# Altium project RFSoC-AMC.PrjPCB (part 4 of 22)

## Sheet AMS_CLOCK.SchDoc: RFSoC AMC
size A2; CompanyName: WUT; DrawnBy: T. Przywozki; Organization: WUT ISE; Address1: Warsaw University of Technology; Address2: Nowowiejska 15/19 00-665 Warsaw; Address3: Tomasz.Przywozki@pw.edu.pl; DocumentNumber: 24; Revision: 1; SheetNumber: 24; SheetTotal: 45; Project: RFSoC AMC; ModifiedBy: T. Przywozki; CreateDate: -; CheckedDate: -; DivGrp: ISE; Designer: T. Przywozki; ModifiedDate: -; ProjectName: ADC/DAC MEZZANINE
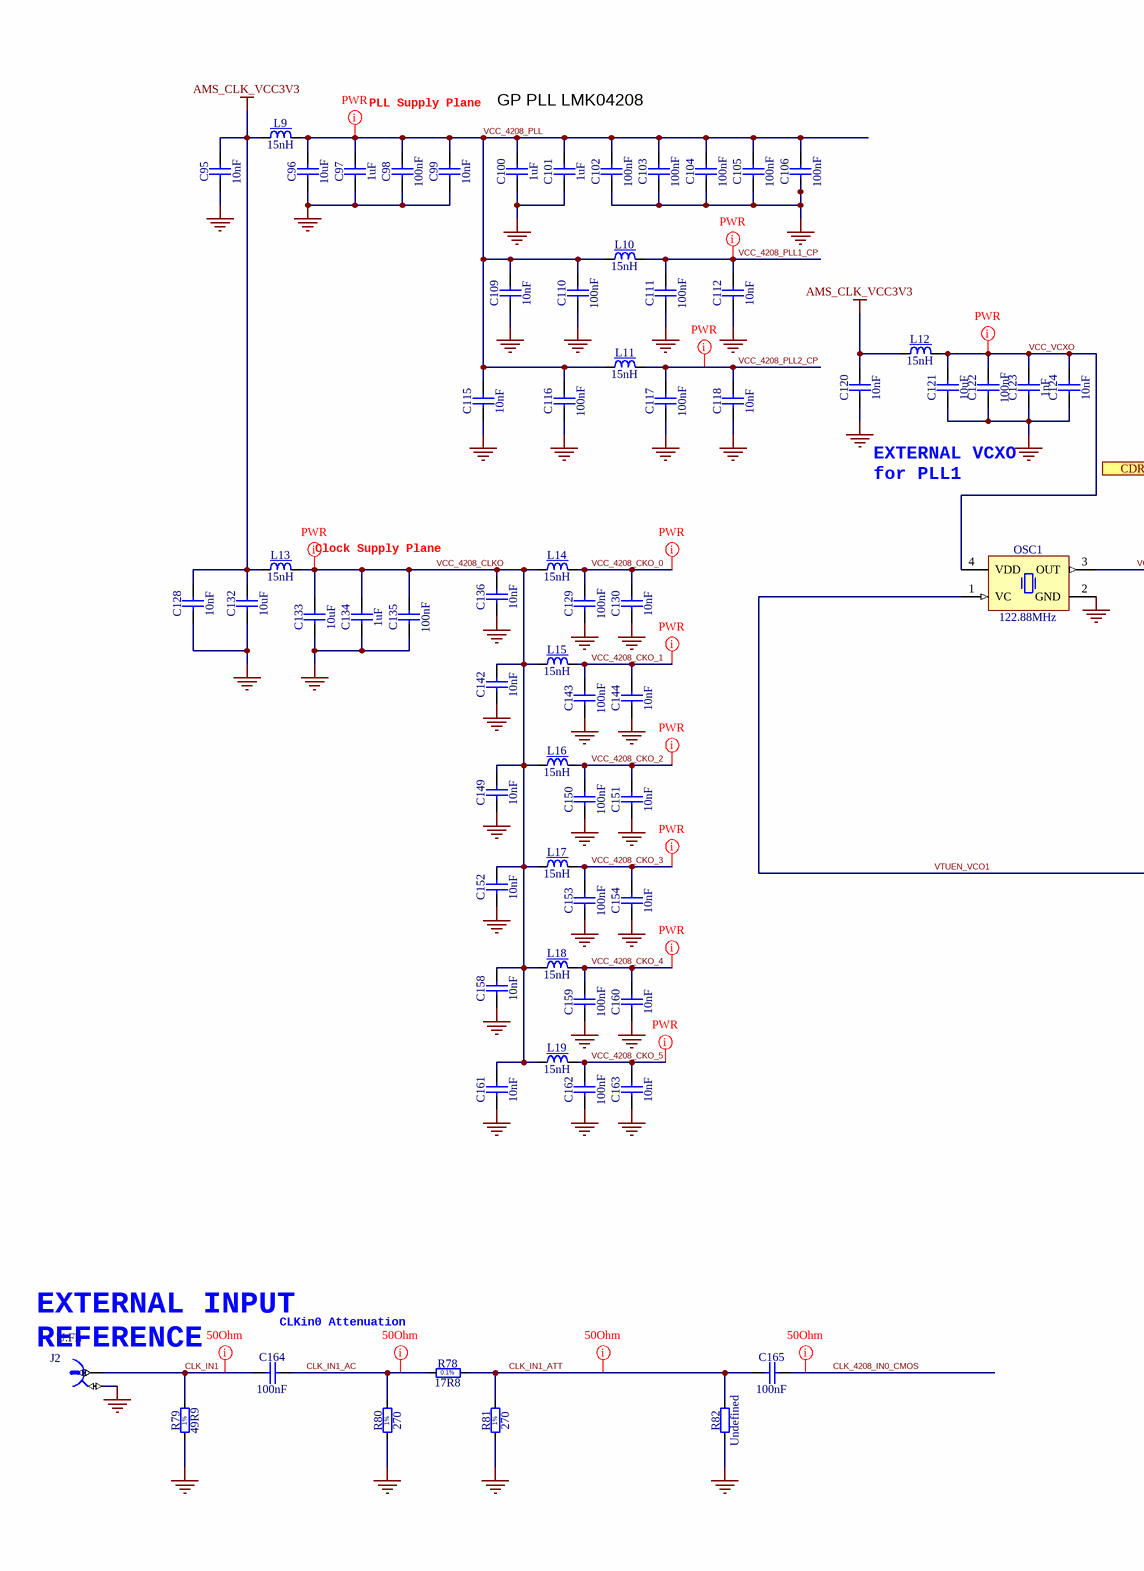
[diagram p7: AMS_CLOCK.SchDoc, left]
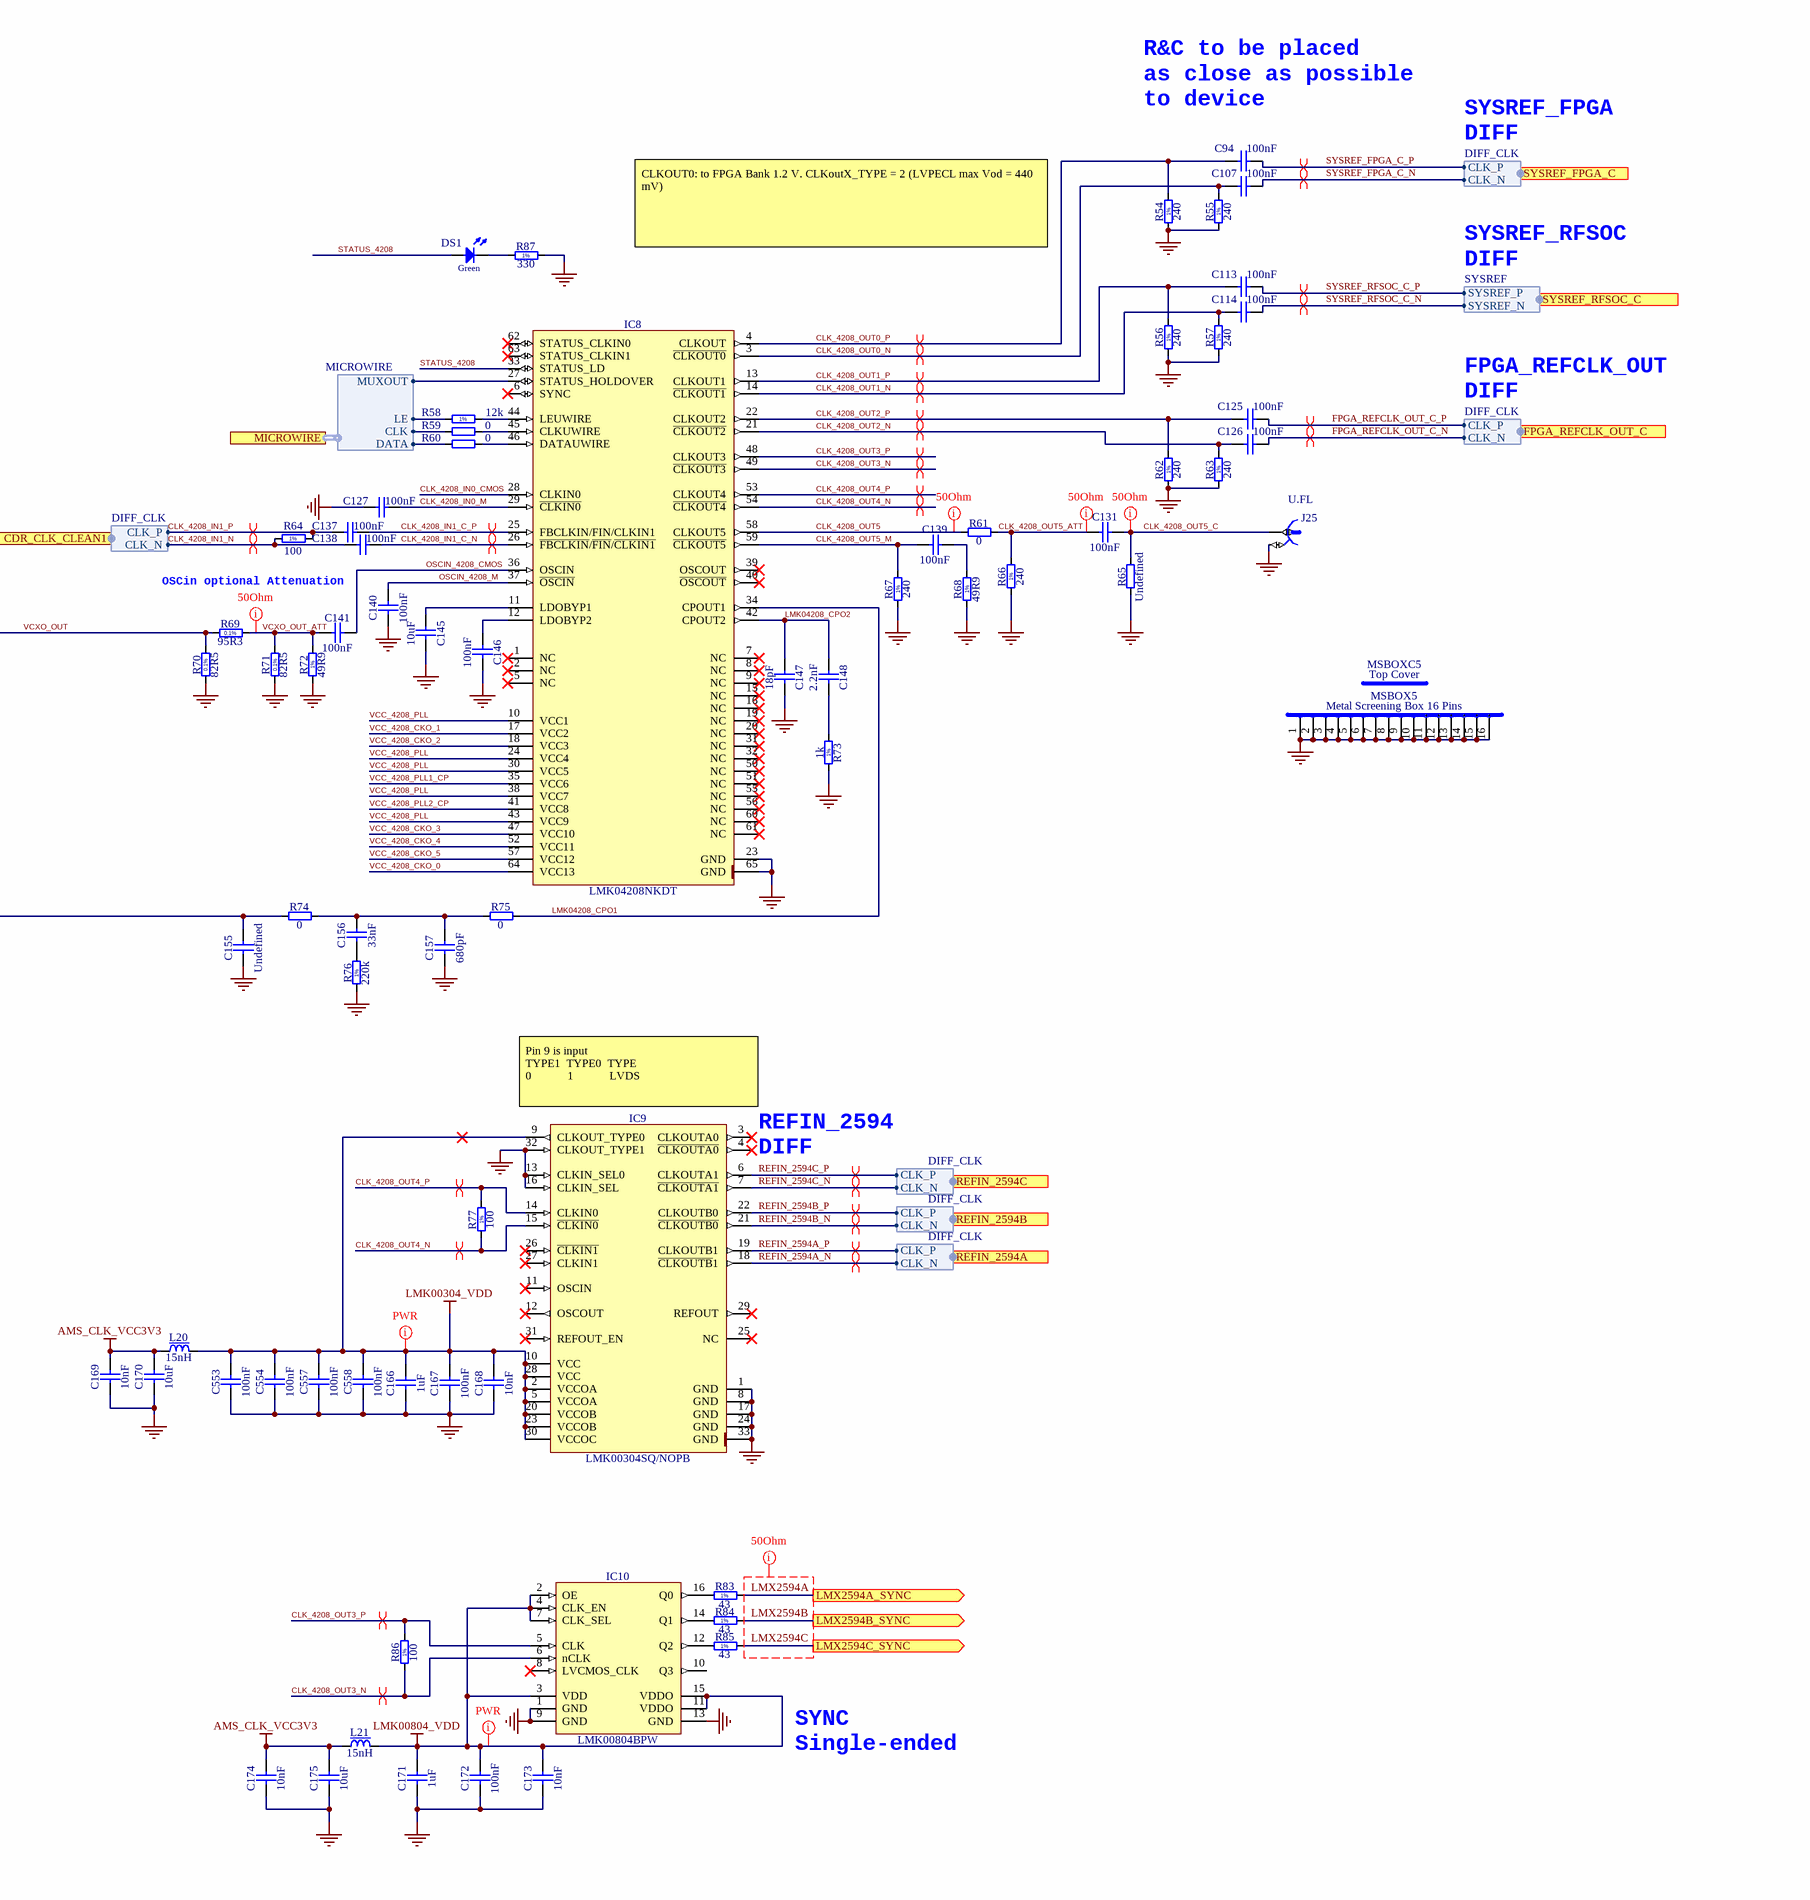
[diagram p8: AMS_CLOCK.SchDoc, right]

### Parts
C94  100nF  [CAPC1005X55N]
C95  10nF  [CAPC1005X55N]
C96  10uF  [CAPC1608X80N]
C97  1uF  [CAPC1005X55N]
C98  100nF  [CAPC1005X55N]
C99  10nF  [CAPC1005X55N]
C100  1uF  [CAPC1005X55N]
C101  1uF  [CAPC1005X55N]
C102  100nF  [CAPC1005X55N]
C103  100nF  [CAPC1005X55N]
C104  100nF  [CAPC1005X55N]
C105  100nF  [CAPC1005X55N]
C106  100nF  [CAPC1005X55N]
C107  100nF  [CAPC1005X55N]
C109  10nF  [CAPC1005X55N]
C110  100nF  [CAPC1005X55N]
C111  100nF  [CAPC1005X55N]
C112  10nF  [CAPC1005X55N]
C113  100nF  [CAPC1005X55N]
C114  100nF  [CAPC1005X55N]
C115  10nF  [CAPC1005X55N]
C116  100nF  [CAPC1005X55N]
C117  100nF  [CAPC1005X55N]
C118  10nF  [CAPC1005X55N]
C120  10nF  [CAPC1005X55N]
C121  10uF  [CAPC1608X80N]
C122  100nF  [CAPC1005X55N]
C123  1nF  [CAPC1005X55N]
C124  10nF  [CAPC1005X55N]
C125  100nF  [CAPC1005X55N]
C126  100nF  [CAPC1005X55N]
C127  100nF  [CAPC1005X55N]
C128  10nF  [CAPC1005X55N]
C129  100nF  [CAPC1005X55N]
C130  10nF  [CAPC1005X55N]
C131  100nF  [CAPC1005X55N]
C132  10uF  [CAPC1608X80N]
C133  10uF  [CAPC1608X80N]
C134  1uF  [CAPC1005X55N]
C135  100nF  [CAPC1005X55N]
C136  10nF  [CAPC1005X55N]
C137  100nF  [CAPC1005X55N]
C138  100nF  [CAPC1005X55N]
C139  100nF  [CAPC1005X55N]
C140  100nF  [CAPC1005X55N]
C141  100nF  [CAPC1005X55N]
C142  10nF  [CAPC1005X55N]
C143  100nF  [CAPC1005X55N]
C144  10nF  [CAPC1005X55N]
C145  10uF  [CAPC1608X80N]
C146  100nF  [CAPC1005X55N]
C147  18pF  [CAPC1005X55N]
C148  2.2nF  [CAPC1005X55N]
C149  10nF  [CAPC1005X55N]
C150  100nF  [CAPC1005X55N]
C151  10nF  [CAPC1005X55N]
C152  10nF  [CAPC1005X55N]
C153  100nF  [CAPC1005X55N]
C154  10nF  [CAPC1005X55N]
C155  Undefined  [CAPC1005X55N]
C156  33nF  [CAPC1608X87N]
C157  680pF  [CAPC1005X55N]
C158  10nF  [CAPC1005X55N]
C159  100nF  [CAPC1005X55N]
C160  10nF  [CAPC1005X55N]
C161  10nF  [CAPC1005X55N]
C162  100nF  [CAPC1005X55N]
C163  10nF  [CAPC1005X55N]
C164  100nF  [CAPC1005X55N]
C165  100nF  [CAPC1005X55N]
C166  1uF  [CAPC1005X55N]
C167  100nF  [CAPC1005X55N]
C168  10nF  [CAPC1005X55N]
C169  10nF  [CAPC1005X55N]
C170  10uF  [CAPC1608X80N]
C171  1uF  [CAPC1005X55N]
C172  100nF  [CAPC1005X55N]
C173  10nF  [CAPC1005X55N]
C174  10nF  [CAPC1005X55N]
C175  10uF  [CAPC1608X80N]
C553  100nF  [CAPC1005X55N]
C554  100nF  [CAPC1005X55N]
C557  100nF  [CAPC1005X55N]
C558  100nF  [CAPC1005X55N]
DS1  Green  [LED_OSRAM_LGL29K]
IC8  LMK04208NKDT  [QFN50P900X900X80-65N-S730]
IC9  LMK00304SQ/NOPB  [QFN50P500X500X80-33N-S320]
IC10  LMK00804BPW  [SOP65P640X120-16N]
J2  U.FL  [HIROSE_U.FL-R-SMT-1(10)]
J25  U.FL  [HIROSE_U.FL-R-SMT-1(10)]
L9  15nH  [IND_COILCRAFT_0402DC]
L10  15nH  [IND_COILCRAFT_0402DC]
L11  15nH  [IND_COILCRAFT_0402DC]
L12  15nH  [IND_COILCRAFT_0402DC]
L13  15nH  [IND_COILCRAFT_0402DC]
L14  15nH  [IND_COILCRAFT_0402DC]
L15  15nH  [IND_COILCRAFT_0402DC]
L16  15nH  [IND_COILCRAFT_0402DC]
L17  15nH  [IND_COILCRAFT_0402DC]
L18  15nH  [IND_COILCRAFT_0402DC]
L19  15nH  [IND_COILCRAFT_0402DC]
L20  15nH  [IND_COILCRAFT_0402DC]
L21  15nH  [IND_COILCRAFT_0402DC]
MSBOX5  Metal Screening Box 16 Pins  [MSBOX_LEADERTECH_SMS-254-F]
MSBOXC5  Top Cover  [MSBOX_LEADERTECH_SMS-254-C]
OSC1  122.88MHz  [OSC_CRYSTEK_CVHD-950]
R54  240  [RESC1005X40N]
R55  240  [RESC1005X40N]
R56  240  [RESC1005X40N]
R57  240  [RESC1005X40N]
R58  12k  [RESC1005X40N]
R59  0  [RESC1005X40N]
R60  0  [RESC1005X40N]
R61  0  [RESC1005X40N]
R62  240  [RESC1005X40N]
R63  240  [RESC1005X40N]
R64  100  [RESC1005X40N]
R65  Undefined  [RESC1005X40N]
R66  240  [RESC1005X40N]
R67  240  [RESC1005X40N]
R68  49R9  [RESC1005X40N]
R69  95R3  [RESC1608X55N]
R70  82R5  [RESC1608X55N]
R71  82R5  [RESC1608X55N]
R72  49R9  [RESC1005X40N]
R73  1k  [RESC1005X40N]
R74  0  [RESC1005X40N]
R75  0  [RESC1005X40N]
R76  220k  [RESC1005X40N]
R77  100  [RESC1005X40N]
R78  17R8  [RESC1608X55N]
R79  49R9  [RESC1005X40N]
R80  270  [RESC1005X40N]
R81  270  [RESC1005X40N]
R82  Undefined  [RESC1005X40N]
R83  43  [RESC1005X40N]
R84  43  [RESC1005X40N]
R85  43  [RESC1005X40N]
R86  100  [RESC1005X40N]
R87  330  [RESC1005X40N]

### Ports
CDR_CLK_CLEAN1 (harness DIFF_CLK), FPGA_REFCLK_OUT_C (out, harness DIFF_CLK), LMX2594A_SYNC (out), LMX2594B_SYNC (out), LMX2594C_SYNC (out), MICROWIRE (harness MICROWIRE), REFIN_2594A (harness DIFF_CLK), REFIN_2594B (out, harness DIFF_CLK), REFIN_2594C (out, harness DIFF_CLK), SYSREF_FPGA_C (out, harness DIFF_CLK), SYSREF_RFSOC_C (harness SYSREF)

### Harnesses
DIFF_CLK: CLK_P, CLK_N
SYSREF: SYSREF_P, SYSREF_N
MICROWIRE: DATA, LE, MUXOUT, CLK

### Nets
AMS_CLK_VCC3V3: C95.2 C120.2 C128.2 C132.2 C169.2 C170.2 C174.2 C175.2 L9.1 L12.1 L13.1 L20.1 L21.1
GND: C95.1 C96.1 C97.2 C98.1 C99.1 C100.1 C101.1 C102.1 C103.1 C104.1 C105.1 C106.1 C109.1 C110.1 C111.1 C112.1 C115.1 C116.1 C117.1 C118.1 C120.1 C121.1 C122.1 C123.1 C124.1 C127.1 C128.1 C129.1 C130.1 C132.1 C133.1 C134.1 C135.1 C136.1 C140.1 C142.1 C143.1 C144.1 C145.1 C146.1 C147.1 C149.1 C150.1 C151.1 C152.1 C153.1 C154.1 C155.1 C157.1 C158.1 C159.1 C160.1 C161.1 C162.1 C163.1 C166.1 C167.1 C168.1 C169.1 C170.1 C171.1 C172.1 C173.1 C174.1 C175.1 C553.1 C554.1 C557.1 C558.1 IC8.23(GND) IC8.65(GND) IC9.1(GND) IC9.8(GND) IC9.13(CLKIN_SEL0) IC9.16(CLKIN_SEL) IC9.17(GND) IC9.24(GND) IC9.32(CLKOUT_TYPE1) IC9.33(GND) IC10.1(GND) IC10.9(GND) IC10.13(GND) J2.2 J25.2 MSBOX5.1 MSBOX5.2 MSBOX5.3 MSBOX5.4 MSBOX5.5 MSBOX5.6 MSBOX5.7 MSBOX5.8 MSBOX5.9 MSBOX5.10 MSBOX5.11 MSBOX5.12 MSBOX5.13 MSBOX5.14 MSBOX5.15 MSBOX5.16 OSC1.2(GND) R54.1 R55.1 R56.1 R57.1 R62.1 R63.1 R65.1 R66.1 R67.1 R68.1 R70.1 R71.1 R72.1 R73.1 R76.1 R79.1 R80.1 R81.1 R82.1 R87.2
LMK00304_VDD: C166.2 C167.2 C168.2 C553.2 C554.2 C557.2 C558.2 IC9.2(VCCOA) IC9.5(VCCOA) IC9.9(CLKOUT_TYPE0) IC9.10(VCC) IC9.20(VCCOB) IC9.23(VCCOB) IC9.28(VCC) IC9.30(VCCOC) L20.2
LMK00804_VDD: C171.2 C172.2 C173.2 IC10.2(OE) IC10.3(VDD) IC10.4(CLK_EN) IC10.7(CLK_SEL) IC10.11(VDDO) IC10.15(VDDO) L21.2
CLK_4208_IN0_CMOS: C165.2 IC8.28(CLKIN0)
CLK_4208_IN0_M: C127.2 IC8.29(~{CLKIN0})
CLK_4208_IN1_C_N: C138.2 IC8.26(~{FBCLKIN}/~{FIN}/~{CLKIN1})
CLK_4208_IN1_C_P: C137.2 IC8.25(FBCLKIN/FIN/CLKIN1)
CLK_4208_IN1_N: C138.1 R64.1 ; port CDR_CLK_CLEAN1.CLK_N
CLK_4208_IN1_P: C137.1 R64.2 ; port CDR_CLK_CLEAN1.CLK_P
CLK_4208_OUT0_N: C107.1 IC8.3(~{CLKOUT0}) R55.2
CLK_4208_OUT0_P: C94.1 IC8.4(CLKOUT) R54.2
CLK_4208_OUT1_N: C114.1 IC8.14(~{CLKOUT1}) R57.2
CLK_4208_OUT1_P: C113.1 IC8.13(CLKOUT1) R56.2
CLK_4208_OUT2_N: C126.1 IC8.21(~{CLKOUT2}) R63.2
CLK_4208_OUT2_P: C125.1 IC8.22(CLKOUT2) R62.2
CLK_4208_OUT3_N: IC8.49(~{CLKOUT3}) IC10.6(nCLK) R86.1
CLK_4208_OUT3_P: IC8.48(CLKOUT3) IC10.5(CLK) R86.2
CLK_4208_OUT4_N: IC8.54(~{CLKOUT4}) IC9.15(~{CLKIN0}) R77.1
CLK_4208_OUT4_P: IC8.53(CLKOUT4) IC9.14(CLKIN0) R77.2
CLK_4208_OUT5: IC8.58(CLKOUT5) R61.1
CLK_4208_OUT5_ATT: C131.1 R61.2 R66.2
CLK_4208_OUT5_C: C131.2 J25.1 R65.2
CLK_4208_OUT5_M: C139.1 IC8.59(~{CLKOUT5}) R67.2
CLK_IN1: C164.1 J2.1 R79.2
CLK_IN1_AC: C164.2 R78.1 R80.2
CLK_IN1_ATT: C165.1 R78.2 R81.2 R82.2
FPGA_REFCLK_OUT_C_N: C126.2 ; port FPGA_REFCLK_OUT_C.CLK_N
FPGA_REFCLK_OUT_C_P: C125.2 ; port FPGA_REFCLK_OUT_C.CLK_P
LMK04208_CPO1: IC8.34(CPOUT1) R75.2
LMK04208_CPO2: C147.2 C148.2 IC8.42(CPOUT2)
LMK_CLK: R59.2 ; port MICROWIRE.CLK
LMK_DATA: R60.2 ; port MICROWIRE.DATA
LMK_LE: R58.2 ; port MICROWIRE.LE
LMK_MUXOUT: IC8.27(STATUS_HOLDOVER) ; port MICROWIRE.MUXOUT
LMX2594A: R83.2 ; port LMX2594A_SYNC
LMX2594B: R84.2 ; port LMX2594B_SYNC  [project net LMX2594A_SYNC]
LMX2594C: R85.2 ; port LMX2594C_SYNC
OSCIN_4208_CMOS: C141.2 IC8.36(OSCIN)
OSCIN_4208_M: C140.2 IC8.37(~{OSCIN})
REFIN_2594A_N: IC9.18(~{CLKOUTB}1) ; port REFIN_2594A.CLK_N
REFIN_2594A_P: IC9.19(CLKOUTB1) ; port REFIN_2594A.CLK_P
REFIN_2594B_N: IC9.21(~{CLKOUTB0}) ; port REFIN_2594B.CLK_N  [project net REFIN_2594A_N]
REFIN_2594B_P: IC9.22(CLKOUTB0) ; port REFIN_2594B.CLK_P  [project net REFIN_2594A_P]
REFIN_2594C_N: IC9.7(~{CLKOUTA1}) ; port REFIN_2594C.CLK_N
REFIN_2594C_P: IC9.6(CLKOUTA1) ; port REFIN_2594C.CLK_P
STATUS_4208: DS1.2(A) IC8.33(STATUS_LD)
SYSREF_FPGA_C_N: C107.2 ; port SYSREF_FPGA_C.CLK_N  [project net FPGA_SYSREF_N]
SYSREF_FPGA_C_P: C94.2 ; port SYSREF_FPGA_C.CLK_P  [project net FPGA_SYSREF_P]
SYSREF_RFSOC_C_N: C114.2 ; port SYSREF_RFSOC_C.SYSREF_N
SYSREF_RFSOC_C_P: C113.2 ; port SYSREF_RFSOC_C.SYSREF_P
VCC_4208_CKO_0: C129.2 C130.2 IC8.64(VCC13) L14.2
VCC_4208_CKO_1: C143.2 C144.2 IC8.17(VCC2) L15.2
VCC_4208_CKO_2: C150.2 C151.2 IC8.18(VCC3) L16.2
VCC_4208_CKO_3: C153.2 C154.2 IC8.47(VCC10) L17.2
VCC_4208_CKO_4: C159.2 C160.2 IC8.52(VCC11) L18.2
VCC_4208_CKO_5: C162.2 C163.2 IC8.57(VCC12) L19.2
VCC_4208_CLKO: C133.2 C134.2 C135.2 C136.2 C142.2 C149.2 C152.2 C158.2 C161.2 L13.2 L14.1 L15.1 L16.1 L17.1 L18.1 L19.1
VCC_4208_PLL: C96.2 C97.1 C98.2 C99.2 C100.2 C101.2 C102.2 C103.2 C104.2 C105.2 C106.2 C109.2 C110.2 C115.2 C116.2 IC8.10(VCC1) IC8.24(VCC4) IC8.30(VCC5) IC8.38(VCC7) IC8.43(VCC9) L9.2 L10.1 L11.1
VCC_4208_PLL1_CP: C111.2 C112.2 IC8.35(VCC6) L10.2
VCC_4208_PLL2_CP: C117.2 C118.2 IC8.41(VCC8) L11.2
VCC_VCXO: C121.2 C122.2 C123.2 C124.2 L12.2 OSC1.4(VDD)
VCXO_OUT: OSC1.3(OUT) R69.1 R70.2
VCXO_OUT_ATT: C141.1 R69.2 R71.2 R72.2
VTUEN_VCO1: C155.2 OSC1.1(VC) R74.1
NetC139_2: C139.2 R68.2
NetC145_2: C145.2 IC8.11(LDOBYP1)
NetC146_2: C146.2 IC8.12(LDOBYP2)
NetC148_1: C148.1 R73.2
NetC156_1: C156.1 R76.2
NetC156_2: C156.2 C157.2 R74.2 R75.1
NetDS1_1: DS1.1(C) R87.1
NetIC8_44: IC8.44(LEUWIRE) R58.1
NetIC8_45: IC8.45(CLKUWIRE) R59.1
NetIC8_46: IC8.46(DATAUWIRE) R60.1
NetIC10_12: IC10.12(Q2) R85.1
NetIC10_14: IC10.14(Q1) R84.1
NetIC10_16: IC10.16(Q0) R83.1

Not connected (* = marked no-connect by the designer): IC8 1(NC)* 2(NC)* 5(NC)* 6(SYNC)* 7(NC)* 8(NC)* 9(NC)* 15(NC)* 16(NC)* 19(NC)* 20(NC)* 31(NC)* 32(NC)* 39(OSCOUT)* 40(~{OSCOUT})* 50(NC)* 51(NC)* 55(NC)* 56(NC)* 60(NC)* 61(NC)* 62(STATUS_CLKIN0)* 63(STATUS_CLKIN1)*; IC9 3(CLKOUTA0)* 4(~{CLKOUTA0})* 11(OSCIN)* 12(OSCOUT)* 25(NC)* 26(~{CLKIN1})* 27(CLKIN1)* 29(REFOUT)* 31(REFOUT_EN)*; IC10 8(LVCMOS_CLK)* 10(Q3)

### Layout directives
mark named 50Ohm: VCXO_OUT_ATT
net class SE50: CLK_4208_IN0_CMOS, CLK_4208_OUT5, CLK_4208_OUT5_ATT, CLK_4208_OUT5_C, CLK_IN1, CLK_IN1_AC, CLK_IN1_ATT, LMX2594A, LMX2594B, LMX2594C
differential pair; differential pair class Diff_100Ohm: CLK_4208_OUT0_N, CLK_4208_OUT0_P, CLK_4208_OUT1_N, CLK_4208_OUT1_P, CLK_4208_OUT2_N, CLK_4208_OUT2_P, CLK_4208_OUT3_N, CLK_4208_OUT3_P, CLK_4208_OUT4_N, CLK_4208_OUT4_P, FPGA_REFCLK_OUT_C_N, FPGA_REFCLK_OUT_C_P, FPGA_SYSREF_N, FPGA_SYSREF_P, REFIN_2594A_N, REFIN_2594A_P, REFIN_2594C_N, REFIN_2594C_P, SYSREF_RFSOC_C_N, SYSREF_RFSOC_C_P
differential pair: CLK_4208_IN1_C_N, CLK_4208_IN1_C_P, CLK_4208_IN1_N, CLK_4208_IN1_P
net class PWR: LMK00304_VDD, LMK00804_VDD, VCC_4208_CKO_0, VCC_4208_CKO_1, VCC_4208_CKO_2, VCC_4208_CKO_3, VCC_4208_CKO_4, VCC_4208_CKO_5, VCC_4208_CLKO, VCC_4208_PLL, VCC_4208_PLL1_CP, VCC_4208_PLL2_CP, VCC_VCXO

### Notes on the sheet
- (near C94) R&C to be placed
  as close as possible
  to device
- SYSREF_FPGA
  DIFF
- PLL Supply Plane
- GP PLL LMK04208
- CLKOUT0: to FPGA Bank 1.2 V. CLKoutX_TYPE = 2 (LVPECL max Vod = 440 mV)
- SYSREF_RFSOC
  DIFF
- FPGA_REFCLK_OUT
  DIFF
- EXTERNAL VCXO
  for PLL1
- OSCin optional Attenuation
- (near L13) Clock Supply Plane
- (near IC9) Pin 9 is input
  TYPE1  TYPE0  TYPE
  0            1            LVDS
- (near IC9) REFIN_2594
  DIFF
- CLKin0 Attenuation
- EXTERNAL INPUT
  REFERENCE
- SYNC
  Single-ended
- Project/Equipment
- Document
- Designer
- Drawn by
- Check.by
- Last Mod.
- Copyright WUT ISE 2021
  This documentation describes Open Hardware and is licensed under CERN OHL v.1.1. You may redistribute and modify this documentaction under the terms of the CERN OHL v1.1.
  (http://ohwr.org/CERNOHL). This documentation is dristributed WITHOUT ANY EXPRESS OR IMPLIED WARRANTY, INCLUDING OF MERCHANTABLITY, SATISFACTORY QUALITY AND FITNESS FOR A PARTICULAR PURPOSE. Please see the CERN OHL v.1.1 for applicable conditions
- Contact:
- File
- Print Date
- Sheet
- Size
- A2
- of
- Rev
- (in symbol R0402_1K_1%_0.0625W_100PPM) 1%
- (in symbol R0402_12K_1%_0.0625W_100PPM) 1%
- (in symbol R0402_43R_1%_0.0625W_100PPM) 1%
- (in symbol R0402_49R9_1%_0.0625W_100PPM) 1%
- (in symbol R0402_100R_1%_0.0625W_100PPM) 1%
- (in symbol R0402_220K_1%_0.0625W_100PPM) 1%
- (in symbol R0402_240R_1%_0.0625W_100PPM) 1%
- (in symbol R0402_270R_1%_0.0625W_100PPM) 1%
- (in symbol R0402_330R_1%_0.0625W_100PPM) 1%
- (in symbol R0603_17R8_0.1%_0.063W_10PPM) 0.1%
- (in symbol R0603_82R5_0.1%_0.063W_10PPM) 0.1%
- (in symbol R0603_95R3_0.1%_0.063W_10PPM) 0.1%

### Library data of the parts
C94 C102-C107 C110 C111 C113 C114 C116 C117 C122 C125-C127 C129 C131 C135 C137-C141 C143 C146 C150 C153 C159 C162 C164 C165 C167 C172 C553 C554 C557 C558 = CC0402_100NF_25V_10%_X7R_YUDEN_TMK105B7104KVHF: Non-polarised capacitor; Part Description: SMD Multilayer Chip Ceramic Capacitor (High Dielectric Type) for Automotive / Industrial Applications; Manufacturer: TAIYO YUDEN; Voltage: 25V; Tolerance: ±10%; TC: X7R; Part Number: CC0402_100NF_25V_10%_X7R_YUDEN_TMK105B7104KVHF; Component Kind: Standard; Component Type: Standard; Pin Count: 2; Value: 100nF; Status: Not Recommended; Manufacturer Part Number: TMK105B7104KVHF; Case: 0402; Mounted: Yes; Socket: No; SMD: Yes; Sense: No; ComponentHeight: 0.55mm; HelpURL: \\cern.ch\dfs\Applications\Altium\Datasheets\CC0402_TAIYO-YUDEN_TMK105B7104KVHF.pdf; Author: CERN DEM JLC; CreateDate: 10.05.2017; LatestRevisionDate: 10.05.2017
C95 C99 = CC0402_10NF_16V_10%_X7R: as C341 on sheet ADC_PLL; Part Number: CC0402_10NF_16V_10%_X7R; Component Kind: Standard; Component Type: Standard; Pin Count: 2; Value: 10nF; Status: Not Recommended; Manufacturer Part Number: CC0402_10NF_16V_10%_X7R; Case: 0402; Mounted: Yes; Socket: No; SMD: Yes; Sense: No; Manufacturer1 Example: PHYCOMP; Manufacturer1 ComponentHeight: 0.55mm; HelpURL: \\cern.ch\dfs\Applications\Altium\Datasheets\CC0402_X7R_PHYCOMP.pdf; Author: CERN DEM JLC; CreateDate: 03.12.2007; LatestRevisionDate: 03.12.2007
C96 = CC0603_10UF_10V_10%_X5R: as C776 on sheet RFMC_DAC; Part Number: CC0603_10UF_10V_10%_X5R; Component Kind: Standard; Component Type: Standard; Pin Count: 2; Value: 10uF; Status: None; Manufacturer Part Number: CC0603_10UF_10V_10%_X5R; Case: 0603; Mounted: Yes; Socket: No; SMD: Yes; Sense: No; Manufacturer1 Example: MURATA; Manufacturer1 ComponentHeight: 0.8mm; HelpURL: \\cern.ch\dfs\Applications\Altium\Datasheets\CC0603_MURATA_GRM188R61A106KE69D.pdf; Author: CERN DEM JLC; CreateDate: 31.01.2017; LatestRevisionDate: 31.01.2017
C97 = CC0402_1UF_16V_10%_X5R: as C932 on sheet RFMC_DAC; Part Number: CC0402_1UF_16V_10%_X5R; Component Kind: Standard; Component Type: Standard; Pin Count: 2; Value: 1uF; Status: Preferred; Manufacturer Part Number: CC0402_1UF_16V_10%_X5R; Case: 0402; Mounted: Yes; Socket: No; SMD: Yes; Sense: No; Manufacturer1 Example: TDK; Manufacturer1 ComponentHeight: 0.55mm; HelpURL: \\cern.ch\dfs\Applications\Altium\Datasheets\CC0402_X5R_TDK_C.pdf; Author: CERN DEM JLC; CreateDate: 25.10.2012; LatestRevisionDate: 25.10.2012
C98 = CC0402_100NF_25V_10%_X7R_YUDEN_TMK105B7104KVHF: as C319 on sheet ADC_PLL; Part Number: CC0402_100NF_25V_10%_X7R_YUDEN_TMK105B7104KVHF; Component Kind: Standard; Component Type: Standard; Pin Count: 2; Value: 100nF; Status: Not Recommended; Manufacturer Part Number: TMK105B7104KVHF; Case: 0402; Mounted: Yes; Socket: No; SMD: Yes; Sense: No; ComponentHeight: 0.55mm; HelpURL: \\cern.ch\dfs\Applications\Altium\Datasheets\CC0402_TAIYO-YUDEN_TMK105B7104KVHF.pdf; Author: CERN DEM JLC; CreateDate: 10.05.2017; LatestRevisionDate: 10.05.2017
C100 C101 C134 C166 C171 = CC0402_1UF_16V_10%_X5R: Non-polarised capacitor; Part Description: SMD Multilayer Chip Ceramic Capacitor; Manufacturer: GENERIC; Manufacturer1 Part Number: C1005X5R1C105KT; Voltage: 16V; Tolerance: ±10%; TC: X5R; Part Number: CC0402_1UF_16V_10%_X5R; Component Kind: Standard; Component Type: Standard; Pin Count: 2; Value: 1uF; Status: Preferred; Manufacturer Part Number: CC0402_1UF_16V_10%_X5R; Case: 0402; Mounted: Yes; Socket: No; SMD: Yes; Sense: No; Manufacturer1 Example: TDK; Manufacturer1 ComponentHeight: 0.55mm; HelpURL: \\cern.ch\dfs\Applications\Altium\Datasheets\CC0402_X5R_TDK_C.pdf; Author: CERN DEM JLC; CreateDate: 25.10.2012; LatestRevisionDate: 25.10.2012
C109 C112 C115 C118 C120 C124 C128 C130 C136 C142 C144 C149 C151 C152 C154 C158 C160 C161 C163 C168 C169 C173 C174 = CC0402_10NF_16V_10%_X7R: Non-polarised capacitor; Part Description: SMD Multilayer Chip Ceramic Capacitor; Manufacturer: GENERIC; Manufacturer1 Part Number: 223878715636; Voltage: 16V; Tolerance: ±10%; TC: X7R; Part Number: CC0402_10NF_16V_10%_X7R; Component Kind: Standard; Component Type: Standard; Pin Count: 2; Value: 10nF; Status: Not Recommended; Manufacturer Part Number: CC0402_10NF_16V_10%_X7R; Case: 0402; Mounted: Yes; Socket: No; SMD: Yes; Sense: No; Manufacturer1 Example: PHYCOMP; Manufacturer1 ComponentHeight: 0.55mm; HelpURL: \\cern.ch\dfs\Applications\Altium\Datasheets\CC0402_X7R_PHYCOMP.pdf; Author: CERN DEM JLC; CreateDate: 03.12.2007; LatestRevisionDate: 03.12.2007
C121 C132 C133 C145 C170 C175 = CC0603_10UF_10V_10%_X5R: Non-polarised capacitor; Part Description: SMD Multilayer Chip Ceramic Capacitor; Manufacturer: GENERIC; Manufacturer1 Part Number: GRM188R61A106KE69D; Voltage: 10V; Tolerance: ±10%; TC: X5R; Part Number: CC0603_10UF_10V_10%_X5R; Component Kind: Standard; Component Type: Standard; Pin Count: 2; Value: 10uF; Status: None; Manufacturer Part Number: CC0603_10UF_10V_10%_X5R; Case: 0603; Mounted: Yes; Socket: No; SMD: Yes; Sense: No; Manufacturer1 Example: MURATA; Manufacturer1 ComponentHeight: 0.8mm; HelpURL: \\cern.ch\dfs\Applications\Altium\Datasheets\CC0603_MURATA_GRM188R61A106KE69D.pdf; Author: CERN DEM JLC; CreateDate: 31.01.2017; LatestRevisionDate: 31.01.2017
C123 = CC0402_1NF_50V_10%_X7R: Non-polarised capacitor; Part Description: SMD Multilayer Chip Ceramic Capacitor; Manufacturer: GENERIC; Manufacturer1 Part Number: 223858715623; Voltage: 50V; TC: X7R; Tolerance: ±10%; Part Number: CC0402_1NF_50V_10%_X7R; Component Kind: Standard; Component Type: Standard; Pin Count: 2; Value: 1nF; Status: Not Recommended; Manufacturer Part Number: CC0402_1NF_50V_10%_X7R; Case: 0402; Mounted: Yes; Socket: No; SMD: Yes; Sense: No; Manufacturer1 Example: PHYCOMP; Manufacturer1 ComponentHeight: 0.55mm; HelpURL: \\cern.ch\dfs\Applications\Altium\Datasheets\CC0402_X7R_PHYCOMP.pdf; Author: CERN DEM JLC; CreateDate: 03.12.2007; LatestRevisionDate: 03.12.2007
C147 = CC0402_18PF_50V_5%_C0G: Non-polarised capacitor; Part Description: SMD Multilayer Chip Ceramic Capacitor; Manufacturer: GENERIC; Manufacturer1 Part Number: C0402C180J5GACTU; Voltage: 50V; TC: C0G/NP0; Tolerance: ±5%; Part Number: CC0402_18PF_50V_5%_C0G; Component Kind: Standard; Component Type: Standard; Pin Count: 2; Value: 18pF; Status: Preferred; Manufacturer Part Number: CC0402_18PF_50V_5%_C0G; Case: 0402; Mounted: Yes; Socket: No; SMD: Yes; Sense: No; Manufacturer1 Example: KEMET; Manufacturer1 ComponentHeight: 0.55mm; HelpURL: \\cern.ch\dfs\Applications\Altium\Datasheets\CC0805_C0G_KEMET_(Commercial Grade).pdf; Author: CERN DEM JLC; CreateDate: 04.10.2016; LatestRevisionDate: 04.10.2016
C148 = CC0402_2.2NF_50V_10%_X7R: Non-polarised capacitor; Part Description: SMD Multilayer Chip Ceramic Capacitor; Manufacturer: GENERIC; Manufacturer1 Part Number: 223858715627; Voltage: 50V; TC: X7R; Tolerance: ±10%; Part Number: CC0402_2.2NF_50V_10%_X7R; Component Kind: Standard; Component Type: Standard; Pin Count: 2; Value: 2.2nF; Status: Not Recommended; Manufacturer Part Number: CC0402_2.2NF_50V_10%_X7R; Case: 0402; Mounted: Yes; Socket: No; SMD: Yes; Sense: No; Manufacturer1 Example: PHYCOMP; Manufacturer1 ComponentHeight: 0.55mm; HelpURL: \\cern.ch\dfs\Applications\Altium\Datasheets\CC0402_X7R_PHYCOMP.pdf; Author: CERN DEM JLC; CreateDate: 03.12.2007; LatestRevisionDate: 03.12.2007
C155 = CC0402_NO-VALUE: as C331 on sheet ADC_PLL; Part Number: CC0402_NO-VALUE; Component Kind: Standard; Component Type: Standard; Pin Count: 2; Value: Undefined; Status: None; Manufacturer: Undefined; Manufacturer Part Number: CC0402_NO-VALUE; Case: 0402; Socket: No; SMD: Yes; Sense: No; Manufacturer1 ComponentHeight: 0.55mm; HelpURL: Undefined; Author: CERN DEM JLC; CreateDate: 14.01.2014; LatestRevisionDate: 14.01.2014
C156 = CC0603_33NF_25V_10%_X7R: Non-polarised capacitor; Part Description: SMD Multilayer Chip Ceramic Capacitor; Manufacturer: GENERIC; Manufacturer1 Part Number: 223891615643; Voltage: 25V; Tolerance: ±10%; TC: X7R; Part Number: CC0603_33NF_25V_10%_X7R; Component Kind: Standard; Component Type: Standard; Pin Count: 2; Value: 33nF; Status: Preferred; Manufacturer Part Number: CC0603_33NF_25V_10%_X7R; Case: 0603; Mounted: Yes; Socket: No; SMD: Yes; Sense: No; Manufacturer1 Example: PHYCOMP; Manufacturer1 ComponentHeight: 0.87mm; HelpURL: \\cern.ch\dfs\Applications\Altium\Datasheets\CC0603_X7R_PHYCOMP.pdf; Author: CERN DEM JLC; CreateDate: 03.12.2007; LatestRevisionDate: 03.12.2007
C157 = CC0402_680PF_50V_5%_X7R: Non-polarised capacitor; Part Description: SMD Multilayer Chip Ceramic Capacitor; Manufacturer: GENERIC; Manufacturer Part Number: CC0402_680PF_50V_10%_X7R; Manufacturer1 Part Number: 223858715621; Voltage: 50V; TC: X7R; Tolerance: ±10%; Part Number: CC0402_680PF_50V_5%_X7R; Component Kind: Standard; Component Type: Standard; Pin Count: 2; Value: 680pF; Status: Not Recommended; Case: 0402; Mounted: Yes; Socket: No; SMD: Yes; Sense: No; Manufacturer1 Example: PHYCOMP; Manufacturer1 ComponentHeight: 0.55mm; HelpURL: \\cern.ch\dfs\Applications\Altium\Datasheets\CC0402_NP0_PHYCOMP.pdf; Author: CERN DEM JLC; CreateDate: 03.12.2007; LatestRevisionDate: 03.12.2007
DS1 = LED_OSRAM_LG L29K-G2J1-24-Z: as DS3 on sheet ADC_PLL; Part Number: LED_OSRAM_LG L29K-G2J1-24-Z; Component Kind: Standard; Component Type: Standard; Color: Green; PackageDescription: Green Chip LED, 2-Leads, Body 1.7x0.8mm, IPC Medium Density; Status: Not Recommended; Manufacturer Part Number: LG L29K-G2J1-24-Z; Pin Count: 2; Case: 0603; Mounted: Yes; Socket: No; SMD: Yes; Sense: No; ComponentHeight: 0.67mm; HelpURL: \\cern.ch\dfs\Applications\Altium\Datasheets\LED_OSRAM_LGL29K.pdf; Author: CERN DEM JLC; CreateDate: 24.04.2012; LatestRevisionDate: 24.04.2012
IC8 = LMK04208NKDT: Low-Noise Clock Jitter Cleaner with Dual Loop PLLs; Manufacturer: TEXAS INSTRUMENTS; PressFit: No; Bonding: No; Part Number: LMK04208NKDT; Component Kind: Standard; Component Type: Standard; Device: LMK04208NKDT; PackageDescription: QFN, 0.50mm Pitch, Square; 64 Pin, 9.00mm L X 9.00mm W X 0.80mm H body (7.30mm X 7.30mm Thermal Tab), IPC Medium Density; Part Description: Low-Noise Clock Jitter Cleaner with Dual Loop PLLs; Manufacturer Part Number: LMK04208NKDT; Pin Count: 65; Case: QFN64; Mounted: Yes; Socket: No; SMD: Yes; Sense: No; ComponentHeight: 0.8mm; Author: CERN DEM JLC; HelpURL: \\cern.ch\dfs\Applications\Altium\Datasheets\LMK04208NKDT.pdf; CreateDate: 04.12.2018; LatestRevisionDate: 04.12.2018
IC9 = LMK00304SQ/NOPB: 3-GHz 4-Output Ultra-Low Additive Jitter Differential Clock Buffer/Level Translator; Part Description: 3GHz 4-Output Ultra-Low Additive Jitter Differential Clock Buffer/Level Translator; Manufacturer: TEXAS INSTRUMENTS; PressFit: No; Bonding: No; Part Number: LMK00304SQ/NOPB; Component Kind: Standard; Component Type: Standard; Device: LMK00304SQ/NOPB; PackageDescription: QFN, 0.50mm Pitch, Square; 32 Pin, 5.00mm L X 5.00mm W X 0.80mm H Body (W/Thermal Tab 3.20mm X 3.20mm), IPC Medium Density; Manufacturer Part Number: LMK00304SQ/NOPB; Pin Count: 33; Case: QFN32; Mounted: Yes; Socket: No; SMD: Yes; Sense: No; ComponentHeight: 0.8mm; Author: CERN DEM JLC; HelpURL: \\cern.ch\dfs\Applications\Altium\Datasheets\LMK00304SQ-NOPB.pdf; CreateDate: 04.12.2018; LatestRevisionDate: 04.12.2018
IC10 = LMK00804BPW: Low Skew, 1-to-4 Multiplexed Differential/LVCMOS-to-LVCMOS/TTL Fanout Buffer; Manufacturer: TEXAS INSTRUMENTS; PressFit: No; Bonding: No; Part Number: LMK00804BPW; Component Kind: Standard; Component Type: Standard; Device: LMK00804BPW; PackageDescription: SOP, 0.65mm pitch; 16 pin, 4.40mm W X 5.00mm L X 1.20mm H body IPC Medium Density; Part Description: Low Skew, 1-to-4 Multiplexed Differential/LVCMOS-to-LVCMOS/TTL Fanout Buffer; Manufacturer Part Number: LMK00804BPW; Pin Count: 16; Case: TSSOP16; Mounted: Yes; Socket: No; SMD: Yes; Sense: No; ComponentHeight: 1.2mm; Author: CERN DEM JLC; HelpURL: \\cern.ch\dfs\Applications\Altium\Datasheets\LMK00804BPW.pdf; CreateDate: 17.02.2015; LatestRevisionDate: 17.02.2015
J2 J25 = HIROSE_U.FL-R-SMT-1(10): Manufacturer: HIROSE (HRS); Part Description: Up to 6GHz Ultra Small Surface Mount Male Coaxial Connectors U.FL Series; PressFit: No; Manufacturer Part Number: U.FL-R-SMT-1(10); Part Number: HIROSE_U.FL-R-SMT-1(10); Component Kind: Standard; Component Type: Standard; Pin Count: 2; Family: U.FL; Mounted: Yes; Socket: No; SMD: Yes; Sense: No; Status: None; ComponentHeight: 1.25mm; HelpURL: \\cern.ch\dfs\Applications\Altium\Datasheets\HIROSE_U.FL-R-SMT-1(10).pdf; Author: CERN DEM JLC; CreateDate: 24.03.2010; LatestRevisionDate: 24.03.2010
L9 = IND0402_15NH_2%_COILCRAFT_0402DC: as L27 on sheet ADC_PLL; Part Number: IND0402_15NH_2%_COILCRAFT_0402DC; Component Kind: Standard; Component Type: Standard; Pin Count: 2; Value: 15nH; Status: None; Manufacturer: COILCRAFT; Case: 0402; Mounted: Yes; Socket: No; SMD: Yes; Sense: No; ComponentHeight: 0.61mm; HelpURL: \\cern.ch\dfs\Applications\Altium\Datasheets\IND0402_COILCRAFT_0402DC.pdf; Author: CERN DEM JLC; CreateDate: 04.12.2018; LatestRevisionDate: 04.12.2018
L10-L21 = IND0402_15NH_2%_COILCRAFT_0402DC: Inductor With Core; Part Description: Ceramic Wirewound Chip Inductor, 0402DC Series; Manufacturer Part Number: 0402DC-15NXGRW; Tolerance: ±2%; Power: 1A; Resistance: 0.115R; Part Number: IND0402_15NH_2%_COILCRAFT_0402DC; Component Kind: Standard; Component Type: Standard; Pin Count: 2; Value: 15nH; Status: None; Manufacturer: COILCRAFT; Case: 0402; Mounted: Yes; Socket: No; SMD: Yes; Sense: No; ComponentHeight: 0.61mm; HelpURL: \\cern.ch\dfs\Applications\Altium\Datasheets\IND0402_COILCRAFT_0402DC.pdf; Author: CERN DEM JLC; CreateDate: 04.12.2018; LatestRevisionDate: 04.12.2018
MSBOX5 = MSBOX_LEADERTECH_SMS-254-F: Part Description: Frame of Standard Surface Mount Shield (Two-Piece), External Dimensions 26.26 x 26.26mm; PressFit: No; Part Number: MSBOX_LEADERTECH_SMS-254-F; Component Kind: Standard; Component Type: Standard; Pin Count: 16; PackageDescription: Frame of Standard Surface Mount Shield (Two-Piece), External Dimensions 26.26 x 26.26mm; Mounted: Yes; Socket: No; SMD: Yes; Sense: No; Status: None; Manufacturer: LEADERTECH; Manufacturer Part Number: SMS-254-F; ComponentHeight: 2.49mm; HelpURL: \\cern.ch\dfs\Applications\Altium\Datasheets\MSBOX_LEADERTECH_SMS-254.pdf; Author: CERN DEM BC; CreateDate: 23.04.2021; LatestRevisionDate: 23.04.2021
MSBOXC5 = MSBOX_LEADERTECH_SMS-254-C: Metal Screening Box - Top Cover 0 Pin; Part Description: Cover for Frame of Standard Surface Mount Shield (Two-Piece), External Dimensions 26.87 x 26.87mm; PressFit: No; Part Number: MSBOX_LEADERTECH_SMS-254-C; Component Kind: Accessories; Component Type: Standard; Pin Count: 0; PackageDescription: Cover for Frame of Standard Surface Mount Shield (Two-Piece), External Dimensions 26.87 x 26.87mm; Mounted: Yes; Socket: No; SMD: Yes; Sense: No; Status: None; Manufacturer: LEADERTECH; Manufacturer Part Number: SMS-254-C; ComponentHeight: 2.74mm; HelpURL: \\cern.ch\dfs\Applications\Altium\Datasheets\MSBOX_LEADERTECH_SMS-254.pdf; Author: CERN DEM BC; CreateDate: 23.04.2021; LatestRevisionDate: 23.04.2021
OSC1 = OSC_122.88MHZ_CRYSTEK_CVHD-950-122.880: Oscillator 4 pins 1=VC 2=GND 3=OUT 4=VDD; Part Description: 3.3V, ±20ppm, 15pF, 0..70°C, CMOS Surface Mount Ultra-Low Noise Oscillator (CVHD-950 Series); Manufacturer: CRYSTEK CRYSTAL; PressFit: No; Bonding: No; Part Number: OSC_122.88MHZ_CRYSTEK_CVHD-950-122.880; Component Kind: Standard; Component Type: Standard; PackageDescription: Oscillator, 5.08mm Pitch; 4 Pin, 14.2mm L X 9.14mm W X 5.3mm H, CVHD-950 Serie; Value: 122.88MHz; Manufacturer Part Number: CVHD-950-122.880; Pin Count: 4; Mounted: Yes; Socket: No; SMD: Yes; Sense: No; ComponentHeight: 5.3mm; HelpURL: \\cern.ch\dfs\Applications\Altium\Datasheets\OSC_CRYSTEK_CVHD-950.pdf; Author: CERN DEM JLC; CreateDate: 30.08.2017; LatestRevisionDate: 30.08.2017
R54-R57 R62 R63 R66 R67 = R0402_240R_1%_0.0625W_100PPM: Resistor - 1%; Part Description: General Purpose Thick Film Chip Resistor; Manufacturer: GENERIC; Manufacturer1 Part Number: 232270672401L; TC: ±100ppm/°C; PressFit: No; Power: 0.0625W; Tolerance: ±1%; Part Number: R0402_240R_1%_0.0625W_100PPM; Component Kind: Standard; Component Type: Standard; Pin Count: 2; Value: 240; Status: Not Recommended; Manufacturer Part Number: R0402_240R_1%_0.0625W_100PPM; Case: 0402; Mounted: Yes; Sense: No; Socket: No; SMD: Yes; Manufacturer1 Example: YAGEO PHYCOMP; Manufacturer1 ComponentHeight: 0.4mm; HelpURL: \\cern.ch\dfs\Applications\Altium\Datasheets\R0402_Phycomp_RC0402.pdf; Author: CERN DEM JLC; CreateDate: 03.12.2007; LatestRevisionDate: 17.10.2012
R58 = R0402_12K_1%_0.0625W_100PPM: as R167 on sheet ADC_PLL; Part Number: R0402_12K_1%_0.0625W_100PPM; Component Kind: Standard; Component Type: Standard; Pin Count: 2; Value: 12k; Status: Not Recommended; Power: 0.0625W; Tolerance: ±1%; Manufacturer Part Number: R0402_12K_1%_0.0625W_100PPM; Case: 0402; Mounted: Yes; Sense: No; Socket: No; SMD: Yes; Manufacturer1 Example: YAGEO PHYCOMP; Manufacturer1 ComponentHeight: 0.4mm; HelpURL: \\cern.ch\dfs\Applications\Altium\Datasheets\R0402_Phycomp_RC0402.pdf; Author: CERN DEM JLC; CreateDate: 03.12.2007; LatestRevisionDate: 17.10.2012
R59-R61 R74 R75 = R0402_0R_JUMPER: as R171 on sheet ADC_PLL; Part Number: R0402_0R_JUMPER; Component Kind: Standard; Component Type: Standard; Pin Count: 2; Value: 0; Status: Not Recommended; Manufacturer Part Number: R0402_0R_JUMPER; Case: 0402; Mounted: Yes; Sense: No; Socket: No; SMD: Yes; Manufacturer1 Example: YAGEO PHYCOMP; Manufacturer1 ComponentHeight: 0.4mm; HelpURL: \\cern.ch\dfs\Applications\Altium\Datasheets\R0402_Phycomp_RC0402.pdf; Author: CERN DEM JLC; CreateDate: 03.12.2007; LatestRevisionDate: 17.10.2012
R64 R77 R86 = R0402_100R_1%_0.0625W_100PPM: Resistor - 1%; Part Description: General Purpose Thick Film Chip Resistor; Manufacturer: GENERIC; Manufacturer1 Part Number: 232270671001L; TC: ±100ppm/°C; PressFit: No; Part Number: R0402_100R_1%_0.0625W_100PPM; Component Kind: Standard; Component Type: Standard; Pin Count: 2; Value: 100; Status: Not Recommended; Power: 0.0625W; Tolerance: ±1%; Manufacturer Part Number: R0402_100R_1%_0.0625W_100PPM; Case: 0402; Mounted: Yes; Sense: No; Socket: No; SMD: Yes; Manufacturer1 Example: YAGEO PHYCOMP; Manufacturer1 ComponentHeight: 0.4mm; HelpURL: \\cern.ch\dfs\Applications\Altium\Datasheets\R0402_Phycomp_RC0402.pdf; Author: CERN DEM JLC; CreateDate: 03.12.2007; LatestRevisionDate: 17.10.2012
R65 R82 = R0402_NO-VALUE: Resistor; Part Description: Reserved Footprint For a 0402 (1005) Chip Resistor; PressFit: No; Mounted: No; Part Number: R0402_NO-VALUE; Component Kind: Standard; Component Type: Standard; Pin Count: 2; Value: Undefined; Status: None; Manufacturer: Undefined; Manufacturer Part Number: R0402_NO-VALUE; Case: 0402; Sense: No; Socket: No; SMD: Yes; Manufacturer1 Example: Undefined; Manufacturer1 Part Number: Undefined; Manufacturer1 ComponentHeight: Undefined; HelpURL: Undefined; Author: CERN DEM JLC; CreateDate: 03.12.2007; LatestRevisionDate: 13.03.2008
R68 R72 R79 = R0402_49R9_1%_0.0625W_100PPM: as R162 on sheet ADC_PLL; Part Number: R0402_49R9_1%_0.0625W_100PPM; Component Kind: Standard; Component Type: Standard; Pin Count: 2; Value: 49R9; Status: Not Recommended; Power: 0.0625W; Tolerance: ±1%; Manufacturer Part Number: R0402_49R9_1%_0.0625W_100PPM; Case: 0402; Mounted: Yes; Sense: No; Socket: No; SMD: Yes; Manufacturer1 Example: YAGEO PHYCOMP; Manufacturer1 ComponentHeight: 0.4mm; HelpURL: \\cern.ch\dfs\Applications\Altium\Datasheets\R0402_Phycomp_RC0402.pdf; Author: CERN DEM JLC; CreateDate: 24.10.2012; LatestRevisionDate: 24.10.2012
R69 = R0603_95R3_0.1%_0.063W_10PPM: Resistor - 0.1%; Part Description: Thin Film Chip Resistor; Manufacturer: GENERIC; Manufacturer1 Part Number: RN73C1J95R3BTDF; Power: 0.063W; TC: ±10ppm; PressFit: No; Part Number: R0603_95R3_0.1%_0.063W_10PPM; Component Kind: Standard; Component Type: Standard; Pin Count: 2; Value: 95R3; Status: Not Recommended; Tolerance: ±0.1%; Manufacturer Part Number: R0603_95R3_0.1%_0.063W_10PPM; Case: 0603; Mounted: Yes; Sense: No; Socket: No; SMD: Yes; Manufacturer1 Example: TYCO HOLSWORTHY; Manufacturer1 ComponentHeight: 0.5mm; HelpURL: \\cern.ch\dfs\Applications\Altium\Datasheets\R0603_Tyco_RN73.pdf; Author: CERN DEM JLC; CreateDate: 03.12.2007; LatestRevisionDate: 13.03.2008
R70 R71 = R0603_82R5_0.1%_0.063W_10PPM: Resistor - 0.1%; Part Description: Thin Film Chip Resistor; Manufacturer: GENERIC; Manufacturer1 Part Number: RN73C1J82R5BTDF; Power: 0.063W; TC: ±10ppm; PressFit: No; Part Number: R0603_82R5_0.1%_0.063W_10PPM; Component Kind: Standard; Component Type: Standard; Pin Count: 2; Value: 82R5; Status: Not Recommended; Tolerance: ±0.1%; Manufacturer Part Number: R0603_82R5_0.1%_0.063W_10PPM; Case: 0603; Mounted: Yes; Sense: No; Socket: No; SMD: Yes; Manufacturer1 Example: TYCO HOLSWORTHY; Manufacturer1 ComponentHeight: 0.5mm; HelpURL: \\cern.ch\dfs\Applications\Altium\Datasheets\R0603_Tyco_RN73.pdf; Author: CERN DEM JLC; CreateDate: 03.12.2007; LatestRevisionDate: 13.03.2008
R73 = R0402_1K_1%_0.0625W_100PPM: Resistor - 1%; Part Description: General Purpose Thick Film Chip Resistor; Manufacturer: GENERIC; Manufacturer1 Part Number: 232270671002L; TC: ±100ppm/°C; PressFit: No; Part Number: R0402_1K_1%_0.0625W_100PPM; Component Kind: Standard; Component Type: Standard; Pin Count: 2; Value: 1k; Status: Not Recommended; Power: 0.0625W; Tolerance: ±1%; Manufacturer Part Number: R0402_1K_1%_0.0625W_100PPM; Case: 0402; Mounted: Yes; Sense: No; Socket: No; SMD: Yes; Manufacturer1 Example: YAGEO PHYCOMP; Manufacturer1 ComponentHeight: 0.4mm; HelpURL: \\cern.ch\dfs\Applications\Altium\Datasheets\R0402_Phycomp_RC0402.pdf; Author: CERN DEM JLC; CreateDate: 03.12.2007; LatestRevisionDate: 17.10.2012
R76 = R0402_220K_1%_0.0625W_100PPM: Resistor - 1%; Part Description: General Purpose Thick Film Chip Resistor; Manufacturer: GENERIC; Manufacturer1 Part Number: 232270672204L; TC: ±100ppm/°C; PressFit: No; Part Number: R0402_220K_1%_0.0625W_100PPM; Component Kind: Standard; Component Type: Standard; Pin Count: 2; Value: 220k; Status: Not Recommended; Power: 0.0625W; Tolerance: ±1%; Manufacturer Part Number: R0402_220K_1%_0.0625W_100PPM; Case: 0402; Mounted: Yes; Sense: No; Socket: No; SMD: Yes; Manufacturer1 Example: YAGEO PHYCOMP; Manufacturer1 ComponentHeight: 0.4mm; HelpURL: \\cern.ch\dfs\Applications\Altium\Datasheets\R0402_Phycomp_RC0402.pdf; Author: CERN DEM JLC; CreateDate: 03.12.2007; LatestRevisionDate: 17.10.2012
R78 = R0603_17R8_0.1%_0.063W_10PPM: Resistor - 0.1%; Part Description: Thin Film Chip Resistor; Manufacturer: GENERIC; Manufacturer1 Part Number: RN73C1J17R8BTDF; Power: 0.063W; TC: ±10ppm; PressFit: No; Part Number: R0603_17R8_0.1%_0.063W_10PPM; Component Kind: Standard; Component Type: Standard; Pin Count: 2; Value: 17R8; Status: Not Recommended; Tolerance: ±0.1%; Manufacturer Part Number: R0603_17R8_0.1%_0.063W_10PPM; Case: 0603; Mounted: Yes; Sense: No; Socket: No; SMD: Yes; Manufacturer1 Example: TYCO HOLSWORTHY; Manufacturer1 ComponentHeight: 0.5mm; HelpURL: \\cern.ch\dfs\Applications\Altium\Datasheets\R0603_Tyco_RN73.pdf; Author: CERN DEM JLC; CreateDate: 03.12.2007; LatestRevisionDate: 13.03.2008
R80 R81 = R0402_270R_1%_0.0625W_100PPM: Resistor - 1%; Part Description: General Purpose Thick Film Chip Resistor; Manufacturer: GENERIC; Manufacturer1 Part Number: 232270672701L; TC: ±100ppm/°C; PressFit: No; Part Number: R0402_270R_1%_0.0625W_100PPM; Component Kind: Standard; Component Type: Standard; Pin Count: 2; Value: 270; Status: Not Recommended; Power: 0.0625W; Tolerance: ±1%; Manufacturer Part Number: R0402_270R_1%_0.0625W_100PPM; Case: 0402; Mounted: Yes; Sense: No; Socket: No; SMD: Yes; Manufacturer1 Example: YAGEO PHYCOMP; Manufacturer1 ComponentHeight: 0.4mm; HelpURL: \\cern.ch\dfs\Applications\Altium\Datasheets\R0402_Phycomp_RC0402.pdf; Author: CERN DEM JLC; CreateDate: 03.12.2007; LatestRevisionDate: 17.10.2012
R83-R85 = R0402_43R_1%_0.0625W_100PPM: Resistor - 1%; Part Description: General Purpose Thick Film Chip Resistor; Manufacturer: GENERIC; Manufacturer1 Part Number: 232270674309L; TC: ±100ppm/°C; PressFit: No; Part Number: R0402_43R_1%_0.0625W_100PPM; Component Kind: Standard; Component Type: Standard; Pin Count: 2; Value: 43; Status: Not Recommended; Power: 0.0625W; Tolerance: ±1%; Manufacturer Part Number: R0402_43R_1%_0.0625W_100PPM; Case: 0402; Mounted: Yes; Sense: No; Socket: No; SMD: Yes; Manufacturer1 Example: YAGEO PHYCOMP; Manufacturer1 ComponentHeight: 0.4mm; HelpURL: \\cern.ch\dfs\Applications\Altium\Datasheets\R0402_Phycomp_RC0402.pdf; Author: CERN DEM JLC; CreateDate: 03.12.2007; LatestRevisionDate: 17.10.2012
R87 = R0402_330R_1%_0.0625W_100PPM: as R176 on sheet ADC_PLL; Tolerance: ±1%; Power: 0.0625W; Part Number: R0402_330R_1%_0.0625W_100PPM; Component Kind: Standard; Component Type: Standard; Pin Count: 2; Value: 330; Status: Not Recommended; Manufacturer Part Number: R0402_330R_1%_0.0625W_100PPM; Case: 0402; Mounted: Yes; Sense: No; Socket: No; SMD: Yes; Manufacturer1 Example: YAGEO PHYCOMP; Manufacturer1 ComponentHeight: 0.4mm; HelpURL: \\cern.ch\dfs\Applications\Altium\Datasheets\R0402_Phycomp_RC0402.pdf; Author: CERN DEM JLC; CreateDate: 03.12.2007; LatestRevisionDate: 17.10.2012